# Altium schematic sheet ASIC.SchDoc: Transceiver ASIC
size A4; Date: 23.09.2023; ApprovedBy: M.Sc. Tobias Wirth; CheckedBy: M.Sc. Tobias Wirth; Author: M.Sc. Tobias Wirth; CompanyName: University of Stuttgart; DrawnBy: M.Sc. Tobias Wirth; Engineer: M.Sc. Tobias Wirth; Organization: IIS; Address1: Pfaffenwaldring 47; Address2: 70569 Stuttgart; Revision: V1.1; SheetNumber: 3; SheetTotal: 3; ProjectNameAlt: AUS - NMR System; Time: 18:00; ImagePath: N/A; Application_BuildNumber: N/A
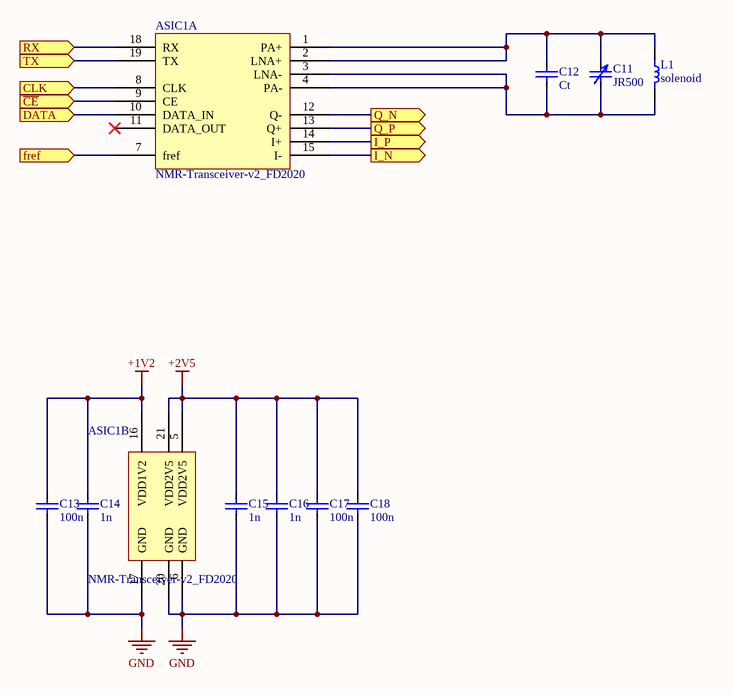
[diagram p0: ASIC.SchDoc]

## Parts
ASIC1  NMR-Transceiver-v2_FD2020  [NMR-Transceiver-FD2020_Interposer-BGA]  (parts A,B of 2)
C11  JR500  [Cap_var]
C12  Ct  [CAP_0402]
C13  100n  [CAP_0402]
C14  1n  [CAP_0402]
C15  1n  [CAP_0402]
C16  1n  [CAP_0402]
C17  100n  [CAP_0402]
C18  100n  [CAP_0402]
L1  solenoid  [Ind_1206]

## Ports
CLK (in), DATA (in), fref (in), I_N (out), I_P (out), Q_N (out), Q_P (out), RX (in), TX (in), ~{CE} (in)

## Nets
+1V2: ASIC1.16(VDD1V2) C13.1 C14.1
+2V5: ASIC1.5(VDD2V5) ASIC1.21(VDD2V5) C15.1 C16.1 C17.1 C18.1
GND: ASIC1.6(GND) ASIC1.17(GND) ASIC1.20(GND) C13.2 C14.2 C15.2 C16.2 C17.2 C18.2
~{CE}: ASIC1.9(CE) ; port ~{CE}
CLK: ASIC1.8(CLK) ; port CLK
DATA: ASIC1.10(DATA_IN) ; port DATA
fref: ASIC1.7(fref) ; port fref
I_N: ASIC1.15(I-) ; port I_N
I_P: ASIC1.14(I+) ; port I_P
Q_N: ASIC1.12(Q-) ; port Q_N
Q_P: ASIC1.13(Q+) ; port Q_P
RX: ASIC1.18(RX) ; port RX
TX: ASIC1.19(TX) ; port TX
NetASIC1_1: ASIC1.1(PA+) ASIC1.2(LNA+) C11.1 C12.1 L1.1
NetASIC1_3: ASIC1.3(LNA-) ASIC1.4(PA-) C11.2 C12.2 L1.2

Not connected (* = marked no-connect by the designer): ASIC1 11(DATA_OUT)*

## Notes on the sheet
- Title
- Size
- Date:
- Sheet
- A4
- of
- Project
- Drawn By:
- Revision:

## Library data of the parts
C11 = Cap_var: Supplier: *; Part Number: *; Value: JR500
C12-C18 = Cap: Supplier: *; Part Number: *
  C12: Value: Ct
  C13 C17 C18: Value: 100n
  C14-C16: Value: 1n
L1 = Ind: Part Number: *; Supplier: *; Value: solenoid